# EasyEDA Pro project TOF_Sensor_Unit.eprj

# Schematic Schematic1
Board Name: Board1; Create Date: 2025-10-15; Page Name: P1; Project Name: TOF_Sensor_Unit; Schematic Name: Schematic1; Update Date: 2025-10-22; Company: EasyEDA.com; Drawn: EasyEDA; Page Size: A4; Part Number: JLCPCB-002; Reviewed: EasyEDA; Version: V0.1
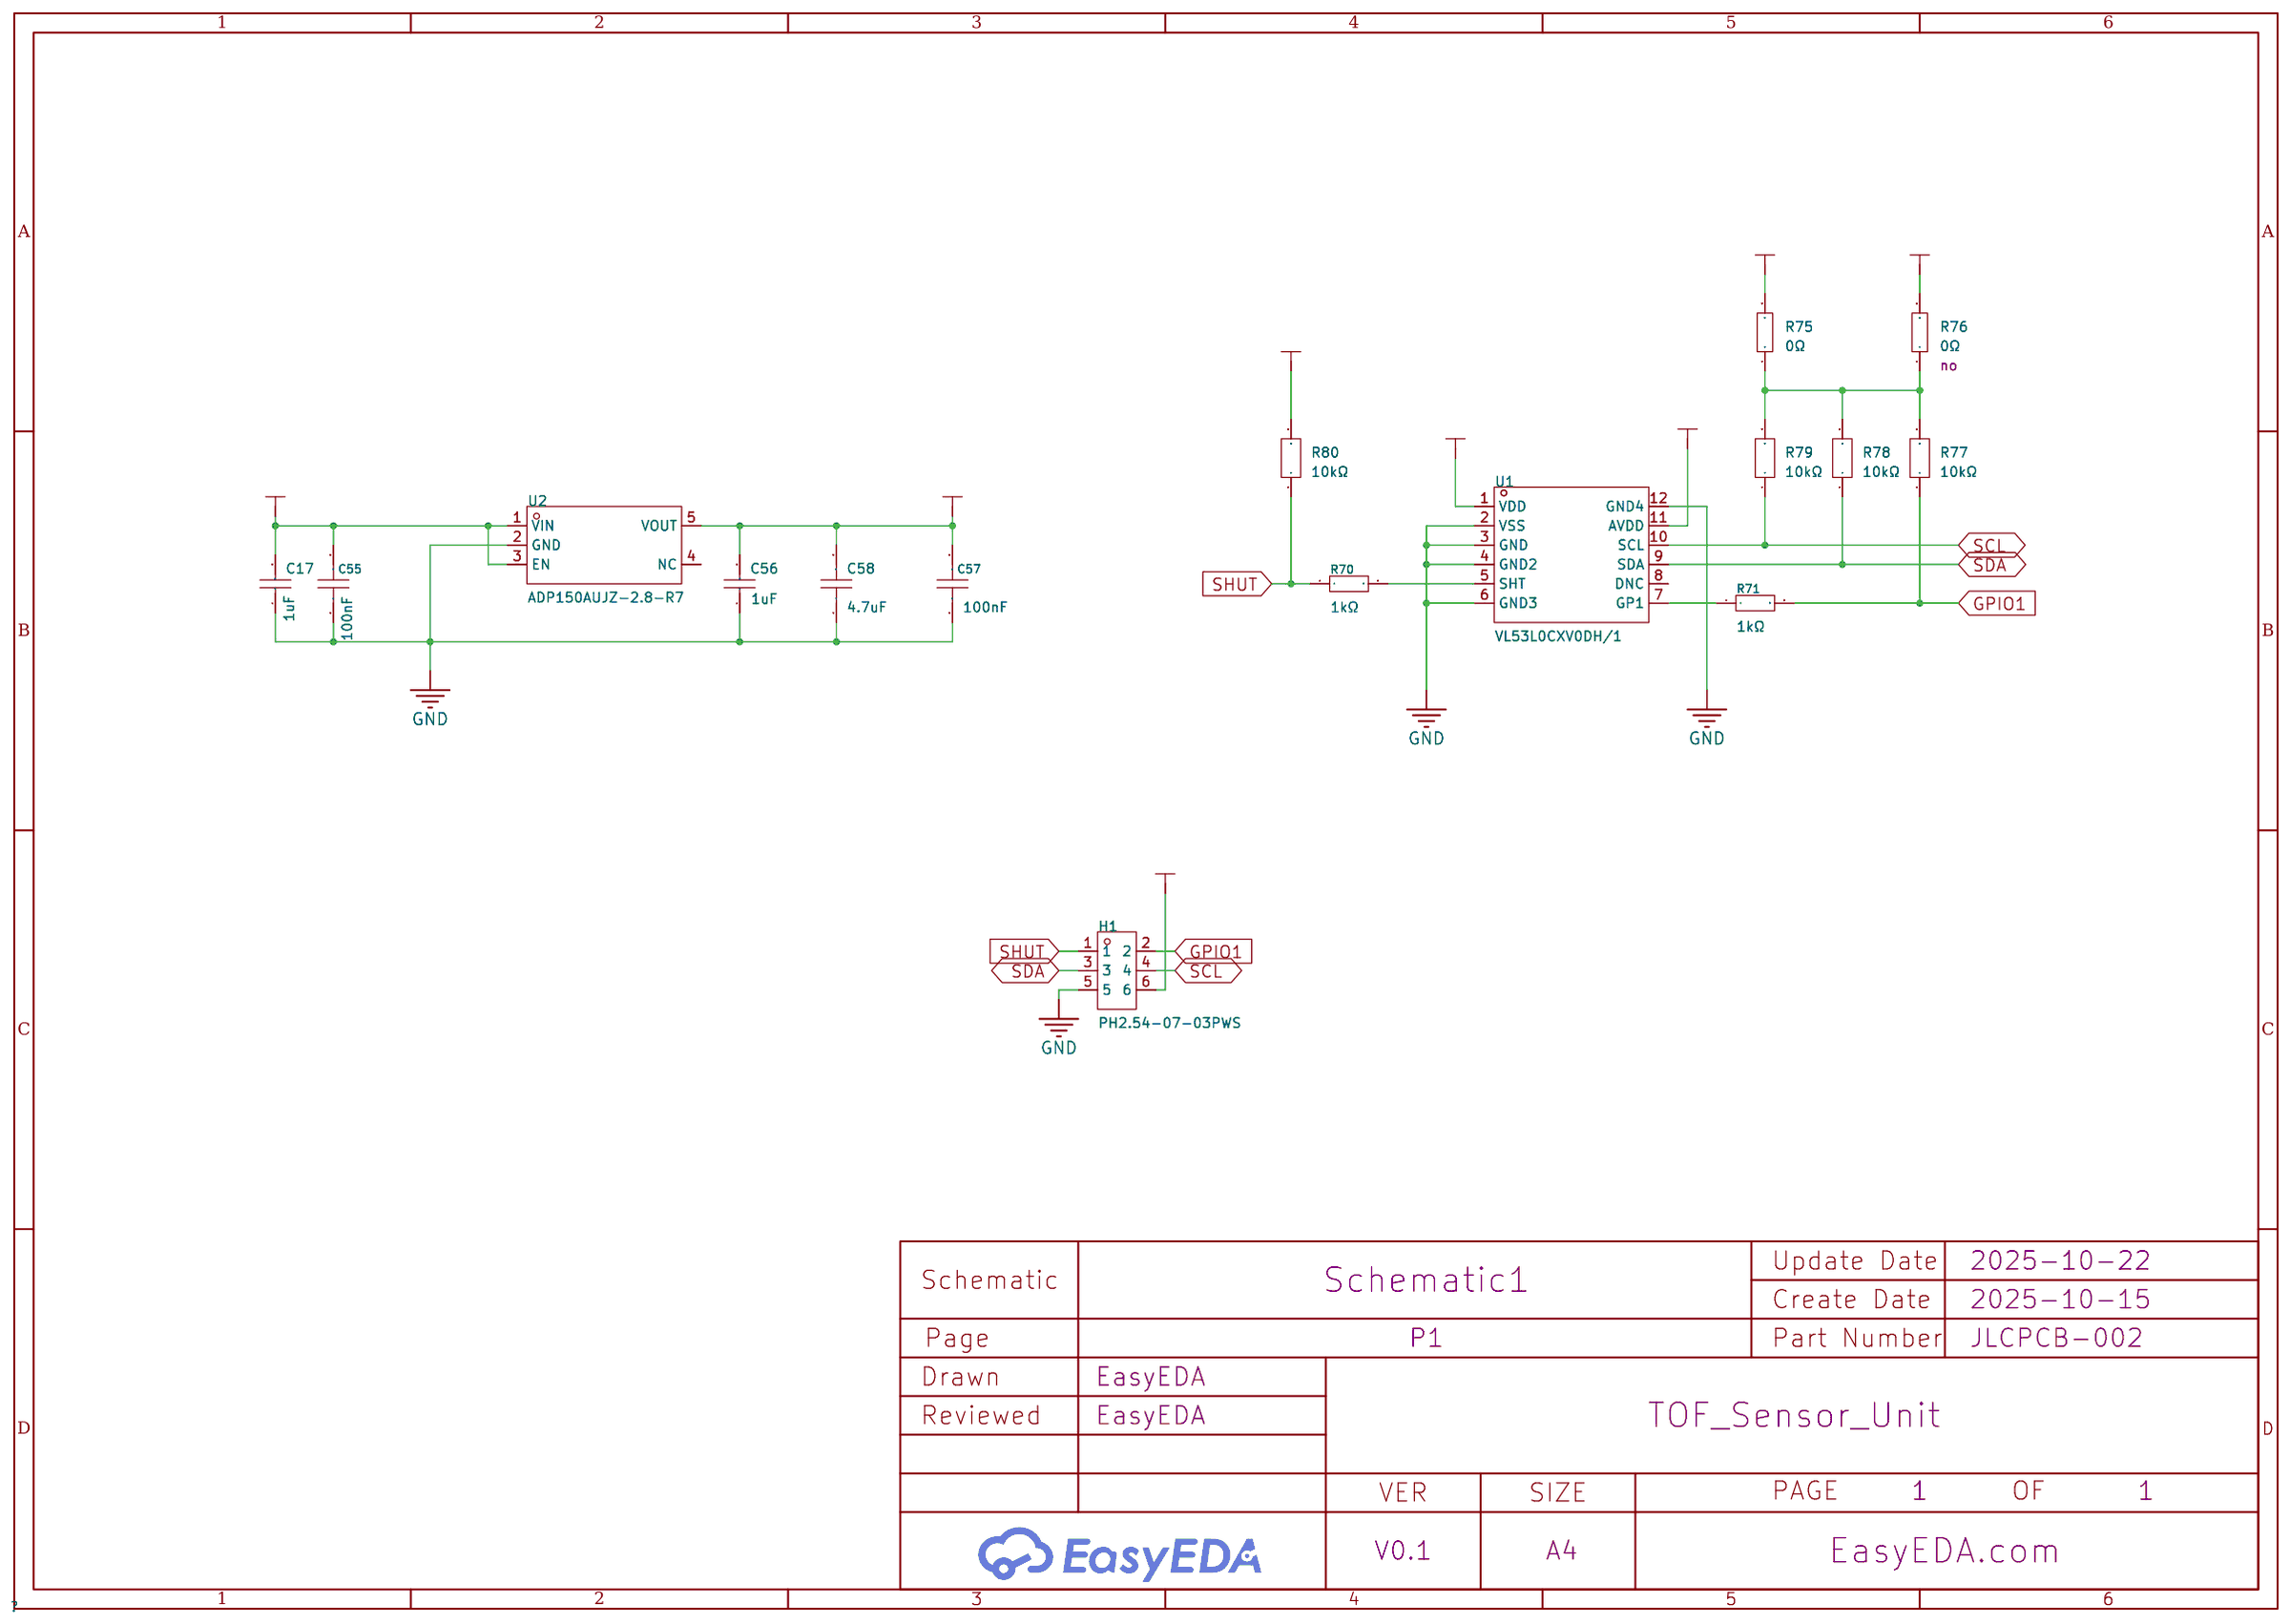
[diagram p0: schematic sheet]

## Parts
C17  1uF  [C0603]
C55  100nF  [C0603]
C56  1uF  [C0603]
C57  100nF  [C0603]
C58  4.7uF  [C0603]
H1  PH2.54-07-03PWS  [HDR-TH_6P-P2.54-H-M-R2-C3-S2.54-W12.3-N]
R70  1kΩ  [R0603]
R71  1kΩ  [R0603]
R75  0Ω  [R0603]
R76  0Ω  [R0603]  (no BOM)
R77  10kΩ  [R0603]
R78  10kΩ  [R0603]
R79  10kΩ  [R0603]
R80  10kΩ  [R0603]
U1  VL53L0CXV0DH/1  [OPTO-SMD_12P_VL53L0CXV0DH-1]
U2  ADP150AUJZ-2.8-R7  [TSOT-23-5_L2.9-W1.6-P0.95-LS2.8-BL]

## Library data of the parts
C17 C56 = CL10A105KO8NNNC: Capacitance: Tolerance:±10% Tolerance:±10% Voltage Rated: Temperature Coefficient:; LCSC Part Name: 1uF ±10% 16V; Supplier Part: C1592; Manufacturer: SAMSUNG(三星); Supplier Footprint: 0603; JLCPCB Part Class: Extended Part; Datasheet: https://atta.szlcsc.com/upload/public/pdf/source/20220919/9FBE606BE0D9532D730F292EB26DC5BB.pdf; Supplier: LCSC; Tolerance: ±10%
C55 C57 = CC0603KRX7R6BB104: Capacitance: Tolerance:±10% Tolerance:±10% Voltage Rated: Temperature Coefficient:; LCSC Part Name: 100nF ±10% 10V; Supplier Part: C519438; Manufacturer: YAGEO(国巨); Supplier Footprint: 0603; JLCPCB Part Class: Extended Part; Datasheet: https://atta.szlcsc.com/upload/public/pdf/source/20200423/C519438_5D8E3909BA347820A92655F61B0D4FC7.pdf; Supplier: LCSC; Tolerance: ±10%
C58 = CGA0603X5R475K250JT: LCSC Part Name: 4.7uF ±10% 25V; Supplier Part: C6119856; Manufacturer: HRE(芯声); Supplier Footprint: 0603; JLCPCB Part Class: Extended Part; Supplier: LCSC; Tolerance: ±10%; Voltage Rating: 25V; Temperature Coefficient: X5R
H1 = PH2.54-07-03PWS: LCSC Part Name: 2x3P 间距:2.54mm 方针 弯插; Supplier Part: C7501617; Manufacturer: XUNPU(讯普); Supplier Footprint: 弯插,P=2.54mm; JLCPCB Part Class: Extended Part; Datasheet: https://item.szlcsc.com/datasheet/PH2.54-07-03PWS/8584171.html; Supplier: LCSC; Pin Structure: 2x3P; Pitch: 2.54mm; Circluar Pins/Square Pins: Pin Header; Mounting Type: Right Angle; Number of Rows: 2; Number of Pins: 6P; Length of Mating Pin: 6mm; Insulation Height: 2.5mm; Contact Material: Brass; Operating Temperature: -40℃~+105℃; Color: Black
R70 R71 = 0603WAF1001T5E: Type:Thick Film Resistors Resistance:1kΩ Tolerance:±1% Tolerance:±1% Power(Watts): Overload Voltage (Max): Temperature Coefficient:±100ppm/℃ Temperature Coefficient:±100ppm/℃ Operating Temperature Range:-55℃~+155℃ Operating Temperature Range:-55℃~+155℃; LCSC Part Name: 1kΩ ±1% 100mW 厚膜电阻; Supplier Part: C21190; Manufacturer: UNI-ROYAL(厚声); Supplier Footprint: 0603; JLCPCB Part Class: Basic Part; Datasheet: https://atta.szlcsc.com/upload/public/pdf/source/20200306/C422600_1E6D84923E4A46A82E41ADD87F860B5C.pdf; Supplier: LCSC; Type: Thick Film Resistors; Tolerance: ±1%; Temperature Coefficient: ±100ppm/℃; Operating Temperature Range: -55℃~+155℃
R75 R76 = 0603WAF0000T5E: LCSC Part Name: 0Ω ±1% 100mW 厚膜电阻; Supplier Part: C21189; Manufacturer: UNI-ROYAL(厚声); Supplier Footprint: 0603; JLCPCB Part Class: Basic Part; Datasheet: https://item.szlcsc.com/datasheet/0603WAF0000T5E/21903.html; Supplier: LCSC; Type: Thick Film Resistor; Tolerance: ±1%; Power(Watts): 100mW; Voltage-Supply(Max): 75V; Operating Temperature: -55℃~+155℃
R77-R80 = FRC0603J103 TS: LCSC Part Name: 10kΩ ±5% 100mW 厚膜电阻; Supplier Part: C2930027; Manufacturer: FOJAN(富捷); Supplier Footprint: 0603; JLCPCB Part Class: Extended Part; Datasheet: https://item.szlcsc.com/datasheet/FRC0603J103%2520TS/3266960.html; Supplier: LCSC; Type: Thick Film Resistor; Tolerance: ±5%; Power(Watts): 100mW; Voltage-Supply(Max): 75V; Temperature Coefficient: ±100ppm/℃; Operating Temperature: -55℃~+155℃
U1 = VL53L0CXV0DH/1: Supplier Part: C91199; Manufacturer: ST(意法半导体); Supplier Footprint: SMD-12P,4.4x2.4mm; JLCPCB Part Class: Extended Part; Datasheet: https://item.szlcsc.com/datasheet/VL53L0CXV0DH%252F1/92388.html; Supplier: LCSC; Linear Range: 200cm
U2 = ADP150AUJZ-2.8-R7: LCSC Part Name: 超低噪声、150 mA CMOS线性调节器; Supplier Part: C208565; Manufacturer: ADI(亚德诺); Supplier Footprint: TSOT-23-5; JLCPCB Part Class: Extended Part; Datasheet: https://item.szlcsc.com/datasheet/ADP150AUJZ-2.8-R7/209597.html; Supplier: LCSC; Output Type: Fixed; Voltage - Supply: 5.5V; Output Voltage: 2.8V; Output Current: 150mA; Power Supply Rejection Ratio (PSRR): 70dB@(10kHz); Voltage Dropout: 105mV@(150mA); standby current: 220uA; Noise: 9uVrms; Features: Over Current Protection；Enable；Over Temperature Protection; Operating Temperature: -40℃~+125℃@(Tj); Output Configuration: Positive; Number of Outputs: 1

## Nets
2V8: C56.2 C57.2 C58.2 R76.2 R80.2 U1.1(VDD) U1.11(AVDD) U2.5(VOUT)
3V3: C17.2 C55.2 H1.6 R75.2 U2.1(VIN) U2.3(EN)
GND: C17.1 C55.1 C56.1 C57.1 C58.1 H1.5 U1.2(VSS) U1.3(GND) U1.4(GND2) U1.6(GND3) U1.12(GND4) U2.2(GND)
GPIO1: H1.2 R71.2 R77.1
SCL: H1.4 R79.1 U1.10(SCL)
SDA: H1.3 R78.1 U1.9(SDA)
SHUT: H1.1 R70.1 R80.1
$1N954: R70.2 U1.5(SHT)
$1N964: R71.1 U1.7(GP1)
$1N1011: R75.1 R76.1 R77.2 R78.2 R79.2

Not connected (* = marked no-connect by the designer): U1 8(DNC); U2 4(NC)

# Board PCB1
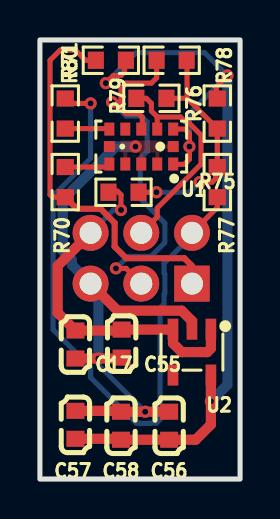
[diagram p1: board, top side]
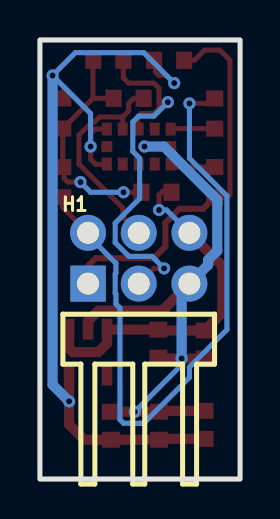
[diagram p2: board, bottom side, seen from below]

Outline 10.03 x 21.97 mm; copper layers: Top Layer, Bottom Layer. Coordinates in mm from the lower left corner of the outline.
Outline path: rectangle 0,21.97 10.03,0
Stack: Top Layer 0.035mm / Dielectric1 1.51mm FR4 er 4.5 / Bottom Layer 0.035mm

## Design rules (mm)
template: JLCPCB Capability(Two Layers Board)
spacing copperThickness1oz (default): track to track 0.102, other pairs 0.152 to 0.3
spacing copperThickness2oz: track to track 0.203, other pairs 0.152 to 0.3
track width copperThickness1oz (default): min 0.127, default 0.254, max 2.54
track width copperThickness2oz: min 0.203, default 0.254, max 2.54
differential pair differentialPair (default): width min 0.127, default 0.254, max 2.54; gap min 0.152, default 0.152
via viaSize (default): diameter min 0.5, default 0.61, max 10; hole min 0.3, default 0.305, max 6.3

## Placement (name value [footprint] x y rotation side)
C17  1uF  [C0603]  1.78 6.73 90 top
C55  100nF  [C0603]  4.1 6.78 90 top
C56  1uF  [C0603]  6.48 2.67 270 top
C57  100nF  [C0603]  1.78 2.71 270 top
C58  4.7uF  [C0603]  4.06 2.67 270 top
H1  PH2.54-07-03PWS  [HDR-TH_6P-P2.54-H-M-R2-C3-S2.54-W12.3-N]  5.08 11.05 180 bottom
R70  1kΩ  [R0603]  1.27 14.86 90 top
R71  1kΩ  [R0603]  1.27 18.29 90 top
R75  0Ω  [R0603]  4.19 14.35 180 top
R76  0Ω  [R0603]  8.89 18.29 90 top
R77  10kΩ  [R0603]  8.89 14.86 90 top
R78  10kΩ  [R0603]  6.6 20.95 0 top
R79  10kΩ  [R0603]  5.59 19.05 0 top
R80  10kΩ  [R0603]  3.56 20.95 0 top
U1  VL53L0CXV0DH/1  [OPTO-SMD_12P_VL53L0CXV0DH-1]  5.08 16.64 0 top
U2  ADP150AUJZ-2.8-R7  [TSOT-23-5_L2.9-W1.6-P0.95-LS2.8-BL]  7.62 6.35 180 top

## Footprints (pads in the part's own frame, mm; a bottom-side part is the same pattern mirrored in y, then rotated)
C0603
  rect 0.8x0.9 smd: 1(-0.7,0) 2(0.7,0)
HDR-TH_6P-P2.54-H-M-R2-C3-S2.54-W12.3-N
  rect 1.778x1.8 hole 1.1: 1(-2.54,-1.27)
  round 1.8 hole 1.1: 2(-2.54,1.27) 3(0,-1.27) 4(0,1.27) 5(2.54,-1.27) 6(2.54,1.27)
OPTO-SMD_12P_VL53L0CXV0DH-1
  rect 0.5x0.65 smd: 1(1.6,-0.875) 2(0.8,-0.875) 3(0,-0.875) 4(-0.8,-0.875) 5(-1.6,-0.875) 7(-1.6,0.875) 8(-0.8,0.875) 9(0,0.875) 10(0.8,0.875) 11(1.6,0.875)
  rect 0.55x0.55 smd: 6(-1.6,0) 12(1.6,0)
R0603
  rect 0.806x0.864 smd: 1(-0.753,0) 2(0.753,0)
TSOT-23-5_L2.9-W1.6-P0.95-LS2.8-BL
  rect 0.532x1.045 smd: 1(-0.95,-1.147) 2(0,-1.147) 3(0.95,-1.147) 4(0.95,1.147) 5(-0.95,1.147)

## Nets
As in the schematic.

Pads without a net: U1 8; U2 4

## Via types
v1: diameter 0.61, hole 0.305, Top Layer to Bottom Layer, 13 vias

## Routing (per net, layer and track width the routed paths; a pad name or vN(x,y) marks a point on that pad's centre or on a via; arc(x,y) is an arc through that point)
2V8: length 44.1
  Top Layer w0.254: R80.2 4.24,20.89 4.24,20.37 4.06,20.19 3.68,20.19 v1(3.3,19.81) ; R76.2 8.84,19.09 8.84,19.63 v1(9.4,20.19) ; U1.1 6.81,15.76 6.82,15.75 7.24,15.75 7.49,16 v1(7.49,16.64) 7.49,17.29 7.27,17.51 U1.11
  Top Layer w0.508: U2.5 v1(8.57,3.89) 8.57,2.73 7.81,1.97 C56.2 C58.2 4.02,2.01 C57.2
  Bottom Layer w0.254: v1(3.3,19.81) 4.83,21.34 8.25,21.34 v1(9.4,20.19) 7.49,18.29 v1(7.49,16.64)
  Bottom Layer w0.508: v1(9.4,20.19) 9.4,4.72 v1(8.57,3.89)
3V3: length 18.2
  Top Layer w0.254: v1(4.06,13.46) 4.06,14.22 3.88,14.4 3.49,14.4 R75.2
  Top Layer w0.508: H1.6 0.89,10.67 0.89,8.32 C17.2 4.05,7.43 C55.2 6.65,7.48 U2.3 6.67,6.79 7.11,6.35 8.38,6.35 8.57,6.54 U2.1
  Bottom Layer w0.254: H1.6 3.68,13.46 v1(4.06,13.46)
GND: length 30.4
  Top Layer w0.508: H1.5 3.89,8.43 7.1,8.43 7.62,7.91 U2.2 ; C55.1 4.05,6.03 v1(2.93,6.03) 1.78,6.03 ; C56.1 v1(5.28,3.37) C58.1 4.02,3.41 C57.1
  Bottom Layer w0.254: v1(2.93,6.03) 2.93,5.71 v1(5.28,3.37)
  Bottom Layer w0.508: v1(4.79,16.64) 3.81,16.64 1.14,13.97 1.14,11.42 1.6,10.96 1.6,10.72 H1.5 2.93,9.39 v1(2.93,6.03)
GPIO1: length 33.5
  Top Layer w0.254: R77.1 8.89,13.59 H1.2 ; R71.2 1.52,18.8 v1(2.54,18.8)
  Bottom Layer w0.254: v1(2.54,18.8) 2.54,16.05 0.66,14.17 0.66,7.47 2.54,5.59 2.54,5.08 4.83,2.79 5.02,2.79 5.03,2.78 5.52,2.78 5.53,2.79 5.84,2.79 6.02,2.97 6.02,8.56 6.22,8.76 6.22,9.25 6.26,9.29 6.26,10.27 6.22,10.3 6.22,10.8 7.62,12.19 H1.2
SCL: length 11
  Top Layer w0.254: 5.88,18.12 5.59,18.42 5.59,18.8 5.33,19.05 R79.1 ; 5.88,18.12 5.89,18.12 7.05,18.12 7.29,17.87 7.42,17.87 8.08,17.21 8.08,15.76 5.88,13.56 5.88,13.12 H1.4 ; 5.88,18.12 U1.10
SDA: length 19.6
  Top Layer w0.254: R78.1 5.85,20.07 5.59,19.81 4.32,19.81 4.06,19.56 4.06,18.87 ; 4.06,18.87 4.06,18.54 4.32,18.29 4.95,18.29 5.13,18.11 5.13,17.56 U1.9 ; 4.06,18.87 4.06,18.86 v1(3.62,18.86) ; H1.3 4.32,10.54 v1(3.81,10.54)
  Bottom Layer w0.254: v1(3.62,18.86) 4.32,18.16 5.08,18.16 5.38,17.86 5.38,16.39 5.03,16.05 5.03,14.03 6.26,12.81 6.26,11.83 5.57,11.14 4.41,11.14 v1(3.81,10.54)
SHUT: length 19.6
  Top Layer w0.254: R70.1 0.63,14.11 0.51,14.22 0.51,20.95 1.02,21.46 1.78,21.46 2.29,20.95 R80.1
  Top Layer w0.305: R70.1 1.85,13.52 3.04,13.52 3.74,12.82 3.74,11.63 4.33,11.05 7.24,11.05 7.62,10.67 H1.1
$1N954: length 2.3
  Top Layer w0.254: R70.2 3.33,15.61 U1.5
$1N964: length 2.2
  Top Layer w0.254: U1.7 3.46,17.53 R71.1
$1N1011: length 11.8
  Top Layer w0.254: R75.1 v1(5.84,14.35) ; 7.37,19.05 R79.2 ; 7.37,19.05 R76.1 R77.2 8.82,15.54 8.82,15.04 8.64,14.86 v1(8,14.86) ; 7.37,19.05 7.37,20.94 R78.2
  Bottom Layer w0.254: v1(5.84,14.35) 7.49,14.35 v1(8,14.86)

## Copper pours and planes (outline as drawn; the poured copper is in the pictures)
GND on Top Layer: 3.18,17.02 6.99,17.02 6.99,15.37 3.18,15.37

Small or netless copper shapes (teardrops, artwork), in the pictures only: 1 on Top Layer
